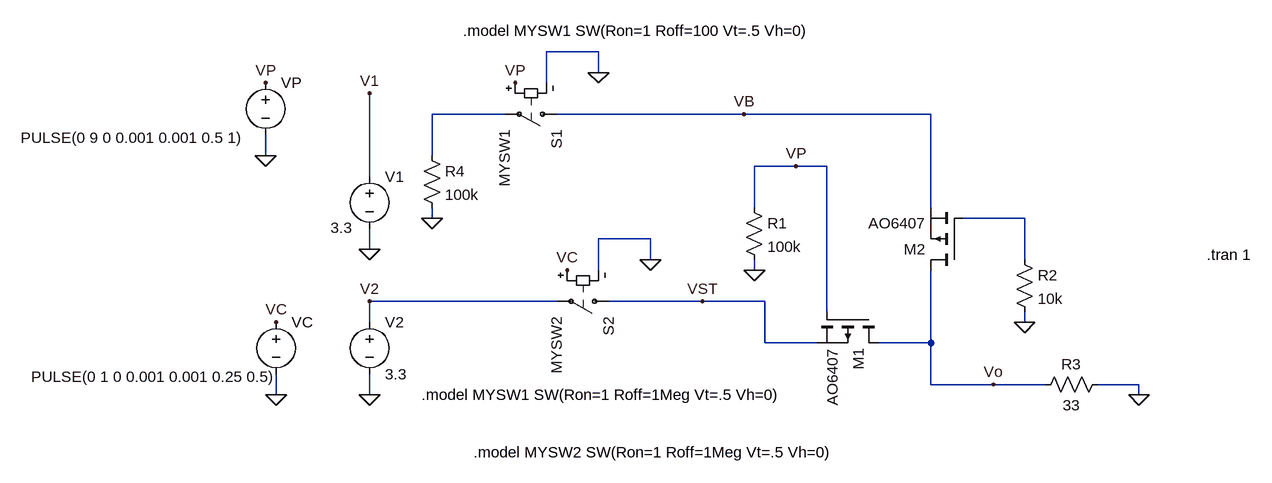
[diagram p0: schematic Full_Power_Selector_7.asc]
Full_Power_Selector_7.asc, the LTspice schematic file:
Version 4
SHEET 1 1032 680
WIRE -48 -144 -128 -144
WIRE -48 -112 -48 -144
WIRE -128 -96 -128 -144
WIRE -192 -48 -304 -48
WIRE 176 -48 -112 -48
WIRE 464 -48 176 -48
WIRE -560 16 -560 -16
WIRE -304 16 -304 -48
WIRE 256 32 192 32
WIRE 304 32 256 32
WIRE -400 48 -400 -80
WIRE 192 96 192 32
WIRE 464 96 464 -48
WIRE -304 112 -304 96
WIRE 608 112 512 112
WIRE 32 144 -48 144
WIRE -400 160 -400 128
WIRE 32 176 32 144
WIRE 608 176 608 112
WIRE -48 192 -48 144
WIRE 192 192 192 176
WIRE -112 240 -400 240
WIRE 112 240 -32 240
WIRE 208 240 112 240
WIRE 304 256 304 32
WIRE -400 272 -400 240
WIRE 608 272 608 256
WIRE 208 304 208 240
WIRE 288 304 208 304
WIRE 464 304 464 192
WIRE 464 304 384 304
WIRE 464 368 464 304
WIRE 560 368 464 368
WIRE 640 368 560 368
WIRE 784 368 720 368
WIRE -544 384 -544 352
WIRE -400 384 -400 352
WIRE 784 384 784 368
FLAG -400 160 0
FLAG -400 384 0
FLAG 192 192 0
FLAG 608 272 0
FLAG 560 368 Vo
FLAG 784 384 0
FLAG -400 -80 V1
FLAG -400 240 V2
FLAG -560 16 0
FLAG -560 -96 VP
FLAG -176 -96 VP
FLAG -48 -112 0
FLAG 32 176 0
FLAG -544 384 0
FLAG -544 272 VC
FLAG -96 192 VC
FLAG 176 -48 VB
FLAG 112 240 VST
FLAG 256 32 VP
FLAG -304 112 0
SYMBOL voltage -400 32 R0
WINDOW 3 -60 95 Left 2
WINDOW 123 0 0 Left 0
WINDOW 39 0 0 Left 0
SYMATTR Value 3.3
SYMATTR InstName V1
SYMBOL voltage -400 256 R0
WINDOW 123 0 0 Left 0
WINDOW 39 0 0 Left 0
SYMATTR InstName V2
SYMATTR Value 3.3
SYMBOL res 176 80 R0
SYMATTR InstName R1
SYMATTR Value 100k
SYMBOL pmos 384 256 R90
SYMATTR InstName M1
SYMATTR Value AO6407
SYMBOL pmos 512 192 R180
SYMATTR InstName M2
SYMATTR Value AO6407
SYMBOL res 592 160 R0
SYMATTR InstName R2
SYMATTR Value 10k
SYMBOL res 736 352 R90
WINDOW 0 0 56 VBottom 2
WINDOW 3 32 56 VTop 2
SYMATTR InstName R3
SYMATTR Value 33
SYMBOL voltage -560 -112 R0
WINDOW 3 -377 100 Left 2
WINDOW 123 0 0 Left 0
WINDOW 39 0 0 Left 0
SYMATTR Value PULSE(0 9 0 0.001 0.001 0.5 1)
SYMATTR InstName VP
SYMBOL sw -96 -48 R90
SYMATTR InstName S1
SYMATTR Value MYSW1
SYMBOL sw -16 240 R90
SYMATTR InstName S2
SYMATTR Value MYSW2
SYMBOL voltage -544 256 R0
WINDOW 3 -377 100 Left 2
WINDOW 123 0 0 Left 0
WINDOW 39 0 0 Left 0
SYMATTR Value PULSE(0 1 0 0.001 0.001 0.25 0.5)
SYMATTR InstName VC
SYMBOL res -320 0 R0
SYMATTR InstName R4
SYMATTR Value 100k
TEXT 888 168 Left 2 !.tran 1
TEXT -256 -176 Left 2 !.model MYSW1 SW(Ron=1 Roff=100 Vt=.5 Vh=0)
TEXT -240 472 Left 2 !.model MYSW2 SW(Ron=1 Roff=1Meg Vt=.5 Vh=0)
TEXT -320 384 Left 2 !.model MYSW1 SW(Ron=1 Roff=1Meg Vt=.5 Vh=0)

The netlist it stands for:
* Full_Power_Selector_7.asc
V1 V1 0 3.3
V2 V2 0 3.3
R1 VP 0 100k
M1 Vo VP VST VST AO6407
M2 Vo N002 VB VB AO6407
R2 N002 0 10k
R3 0 Vo 33
VP VP 0 PULSE(0 9 0 0.001 0.001 0.5 1)
S1 VB N001 VP 0 MYSW1
S2 VST V2 VC 0 MYSW2
VC VC 0 PULSE(0 1 0 0.001 0.001 0.25 0.5)
R4 N001 0 100k
.model NMOS NMOS
.model PMOS PMOS
.lib standard.mos
.tran 1
.model MYSW1 SW(Ron=1 Roff=100 Vt=.5 Vh=0)
.model MYSW2 SW(Ron=1 Roff=1Meg Vt=.5 Vh=0)
.model MYSW1 SW(Ron=1 Roff=1Meg Vt=.5 Vh=0)
.backanno
.end